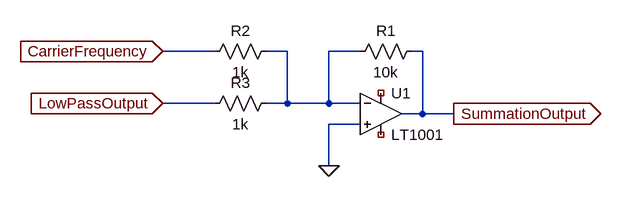
[diagram p0: schematic Draft1.asc]
Draft1.asc, the LTspice schematic file:
Version 4
SHEET 1 880 680
WIRE -32 48 -112 48
WIRE 80 48 48 48
WIRE 192 48 144 48
WIRE 288 48 272 48
WIRE -32 128 -112 128
WIRE 80 128 80 48
WIRE 80 128 48 128
WIRE 144 128 144 48
WIRE 144 128 80 128
WIRE 192 128 144 128
WIRE 288 144 288 48
WIRE 288 144 256 144
WIRE 336 144 288 144
WIRE 192 160 144 160
WIRE 144 224 144 160
FLAG 144 224 0
FLAG -112 48 CarrierFrequency
IOPIN -112 48 In
FLAG -112 128 LowPassOutput
IOPIN -112 128 In
FLAG 336 144 SummationOutput
IOPIN 336 144 Out
SYMBOL Opamps\\LT1001 224 80 R0
SYMATTR InstName U1
SYMBOL res 288 32 R90
WINDOW 0 0 56 VBottom 2
WINDOW 3 32 56 VTop 2
SYMATTR InstName R1
SYMATTR Value 10k
SYMBOL res 64 32 R90
WINDOW 0 0 56 VBottom 2
WINDOW 3 32 56 VTop 2
SYMATTR InstName R2
SYMATTR Value 1k
SYMBOL res 64 112 R90
WINDOW 0 0 56 VBottom 2
WINDOW 3 32 56 VTop 2
SYMATTR InstName R3
SYMATTR Value 1k

The netlist it stands for:
* Draft1.asc
XU1 0 N001 NC_01 NC_02 SummationOutput LT1001  ; pins In+ In- V+ V- OUT
R1 SummationOutput N001 10k
R2 N001 CarrierFrequency 1k
R3 N001 LowPassOutput 1k
.lib LTC.lib
.backanno
.end